# EAGLE schematic Mini_Function_Generator_and_Counter (EAGLE 6.4)
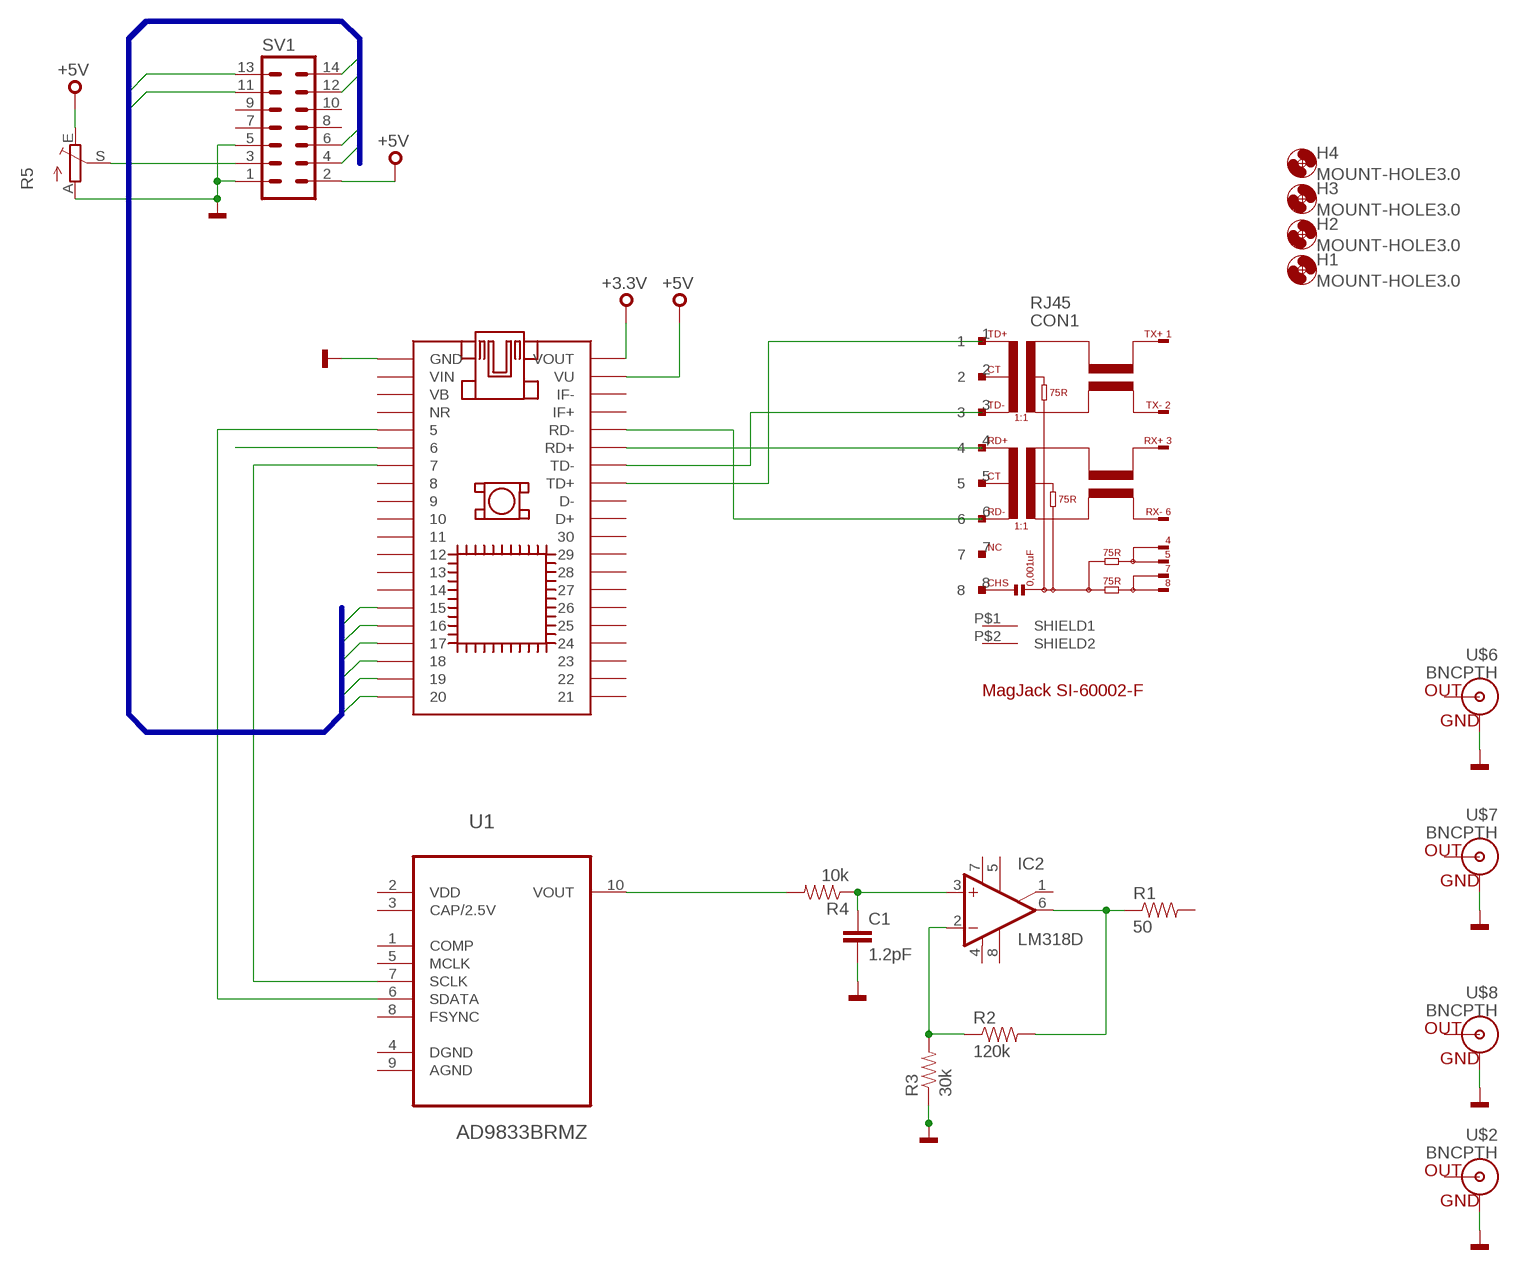
[diagram p0: schematic, sheet 1]

## Parts
C1  1.2pF  CAP0805  [0805]
CON1  RJ45  [RJ45]
H1  MOUNT-HOLE3.0  [3,0]
H2  MOUNT-HOLE3.0  [3,0]
H3  MOUNT-HOLE3.0  [3,0]
H4  MOUNT-HOLE3.0  [3,0]
IC1  MBED-SOCKET  [MBED-SOCKET]
IC2  LM318D  [SO08]
R1  50  RESISTOR  [0805]
R2  120k  RESISTOR  [0805]
R3  30k  RESISTOR  [0805]
R4  10k  RESISTOR  [0805]
R5  TRIM_EU-PT10  [PT-10]
SV1  14PL  [14PL]
U1  AD9833BRMZ  [SOP50P490X110-10N]
U$2  BNCPTH  [BNC]
U$6  BNCPTH  [BNC]
U$7  BNCPTH  [BNC]
U$8  BNCPTH  [BNC]

## Nets
+3,3V: IC1.P$40(VOUT) ; supply symbol labelled +3.3V
+5V: IC1.P$39(VU) R5.E SV1.2
D4: IC1.P$17 SV1.11
D5: IC1.P$18 SV1.12
D6: IC1.P$19 SV1.13
D7: IC1.P$20 SV1.14
E: IC1.P$16 SV1.4
GND: C1.2 IC1.P$1(GND) R3.1 R5.A SV1.1 SV1.5 U$2.GND U$6.GND U$7.GND U$8.GND
N$1: CON1.1 IC1.P$33(TD+)
N$2: CON1.3 IC1.P$34(TD-)
N$3: CON1.4 IC1.P$35(RD+)
N$4: CON1.6 IC1.P$36(RD-)
N$5: IC2.6(OUT) R1.1 R2.2
N$6: IC2.2(-IN) R2.1 R3.2
N$7: C1.1 IC2.3(+IN) R4.1
N$8: R4.2 U1.10(VOUT)
N$9: IC1.P$5 U1.6(SDATA)
N$10: IC1.P$6
N$11: IC1.P$7 U1.7(SCLK)
N$12: R5.S SV1.3
RS: IC1.P$15 SV1.6
Unconnected: CON1.2 CON1.5 CON1.7 CON1.8 CON1.P$1(SHIELD1) CON1.P$2(SHIELD2) IC1.P$2(VIN) IC1.P$3(VB) IC1.P$4(NR) IC1.P$8 IC1.P$9 IC1.P$10 IC1.P$11 IC1.P$12 IC1.P$13 IC1.P$14 IC1.P$21 IC1.P$22 IC1.P$23 IC1.P$24 IC1.P$25 IC1.P$26 IC1.P$27 IC1.P$28 IC1.P$29 IC1.P$30 IC1.P$31(D+) IC1.P$32(D-) IC1.P$37(IF+) IC1.P$38(IF-) IC2.1(ON/CMP) IC2.5(ON) IC2.8(CMP) R1.2 SV1.7 SV1.8 SV1.9 SV1.10 U1.1(COMP) U1.3(CAP/2.5V) U1.4(DGND) U1.5(MCLK) U1.8(FSYNC) U1.9(AGND) U$2.S(OUT) U$6.S(OUT) U$7.S(OUT) U$8.S(OUT)

## Buses
TEXT_LCD:D[4..7],RS,E

## Power pins joined to a net without a drawn wire
V+: IC2.7(V+)
V-: IC2.4(V-)
VDD: U1.2(VDD)

## Library data of the parts
C1 = SparkFun:CAP: Capacitor Standard 0603 ceramic capacitor, and 0.1" leaded capacitor.
CON1 = mbed-connectors:RJ45: Magjack SI-68002
H1-H4 = holes:MOUNT-HOLE: MOUNTING HOLE with drill center marker
IC1 = mbed-microcontroller:MBED-SOCKET
IC2 = linear:LM318: OP AMP
R1-R4 = SparkFun:RESISTOR: Resistor Basic schematic elements and footprints for 0603, 1206, and PTH 1/10th watt (small) resistors.
R5 = pot:TRIM_EU-: POTENTIOMETER
SV1 = con-dil:14PL: DIL CABLE CONNECTOR
U1 = AD9833BRMZ:AD9833BRMZ: Low Power 12.65 mW, 2.3 V to 5.5 V,Low Power 12.65 mW, 2.3 V to 5.5 V,Low Power 12.65 mW, 2.3 V to 5.5 V,Programmable Waveform Generator; MPN: AD9833BRMZ; OC_FARNELL: 1581966; OC_NEWARK: 19M1014; PACKAGE: MSOP-10; SUPPLIER: Analog Devices
U$2 U$6-U$8 = SparkFun:BNC: BNC Connector, Mouser Part# 5227161